# EAGLE design SMS to Genesis (EAGLE 6.5.0)
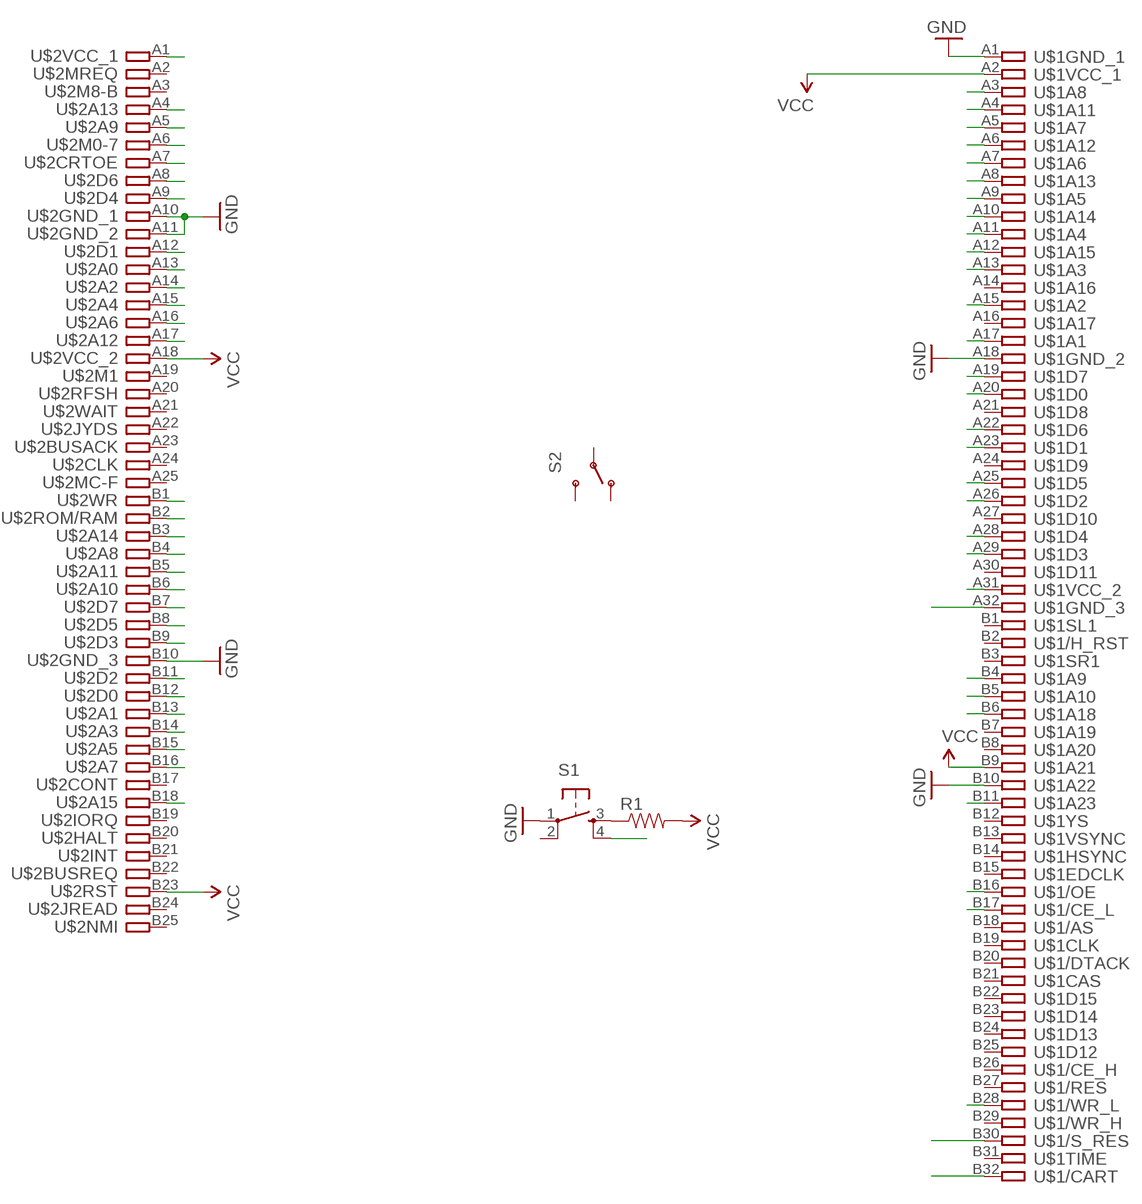
[diagram p0: schematic, sheet 1]

## Parts
R1  RESISTOR0805-RES  [0805]
S1  TAC_SWITCHSMD  [TACTILE-SWITCH-SMD]
S2  SWITCH-SPDTPTH  [SWITCH-SPDT]
U$1  GENESIS-LARGE  [GENESIS-LARGE]
U$2  SMS-R  [SMS]

## Nets
A3: U$1.A3 U$2.B16
A4: U$1.A4 U$2.B6
A5: U$1.A5 U$2.A16
A6: U$1.A6 U$2.B5
A7: U$1.A7 U$2.B15
A8: U$1.A8 U$2.A17
A9: U$1.A9 U$2.A15
A10: U$1.A10 U$2.A4
A11: U$1.A11 U$2.B14
A12: U$1.A12 U$2.B3
A13: U$1.A13 U$2.A14
A15: U$1.A15 U$2.B13
A17: U$1.A17 U$2.A13
A19: U$1.A19 U$2.B7
A20: U$1.A20 U$2.B12
A22: U$1.A22 U$2.A8
A23: U$1.A23 U$2.A12
A25: U$1.A25 U$2.B8
A26: U$1.A26 U$2.B11
A28: U$1.A28 U$2.A9
A29: U$1.A29 U$2.B9
A31: U$1.A31 U$2.A1
B4: U$1.B4 U$2.B4
B5: U$1.B5 U$2.A5
B6: U$1.B6 U$2.A7
B11: S1.4 U$1.B11
B16: U$1.B16 U$2.B2
B17: U$1.B17 U$2.A6 U$2.B18
B28: U$1.B28 U$2.B1
GND: S1.1 U$1.A1 U$1.A18 U$1.B10 U$2.A10 U$2.A11 U$2.B10
N$1: R1.1 S1.3
SMS: U$1.A32 U$1.B30 U$1.B32
VCC: R1.2 U$1.A2 U$1.B9 U$2.A18 U$2.B23
Unconnected: S1.2 S2.1(O) S2.2(P) S2.3(S) U$1.A14 U$1.A16 U$1.A21 U$1.A24 U$1.A27 U$1.A30 U$1.B1 U$1.B2 U$1.B3 U$1.B7 U$1.B8 U$1.B12 U$1.B13 U$1.B14 U$1.B15 U$1.B18 U$1.B19 U$1.B20 U$1.B21 U$1.B22 U$1.B23 U$1.B24 U$1.B25 U$1.B26 U$1.B27 U$1.B29 U$1.B31 U$2.A2 U$2.A3 U$2.A19 U$2.A20 U$2.A21 U$2.A22 U$2.A23 U$2.A24 U$2.A25 U$2.B17 U$2.B19 U$2.B20 U$2.B21 U$2.B22 U$2.B24 U$2.B25

## Library data of the parts
R1 = SparkFun-Passives:RESISTOR: Resistor Basic schematic elements and footprints for 0603, 1206, and PTH resistors.
S1 = SparkFun-Electromechanical:TAC_SWITCH: Momentary Switch Button commonly used for reset or general input. Spark Fun Electronics SKU : COM-00097 SMT- SWCH-08247
S2 = SparkFun-Electromechanical:SWITCH-SPDT: SPDT Switch Simple slide switch, Spark Fun Electronics SKU : COM-00102 DPDT SMT slide switch, AYZ0202, SWCH-08179
U$1 = genesis:GENESIS: Sega Genesis cartridge connector
U$2 = sms:SMS-R: Sega Master System cartridge connector, reversed

## Board
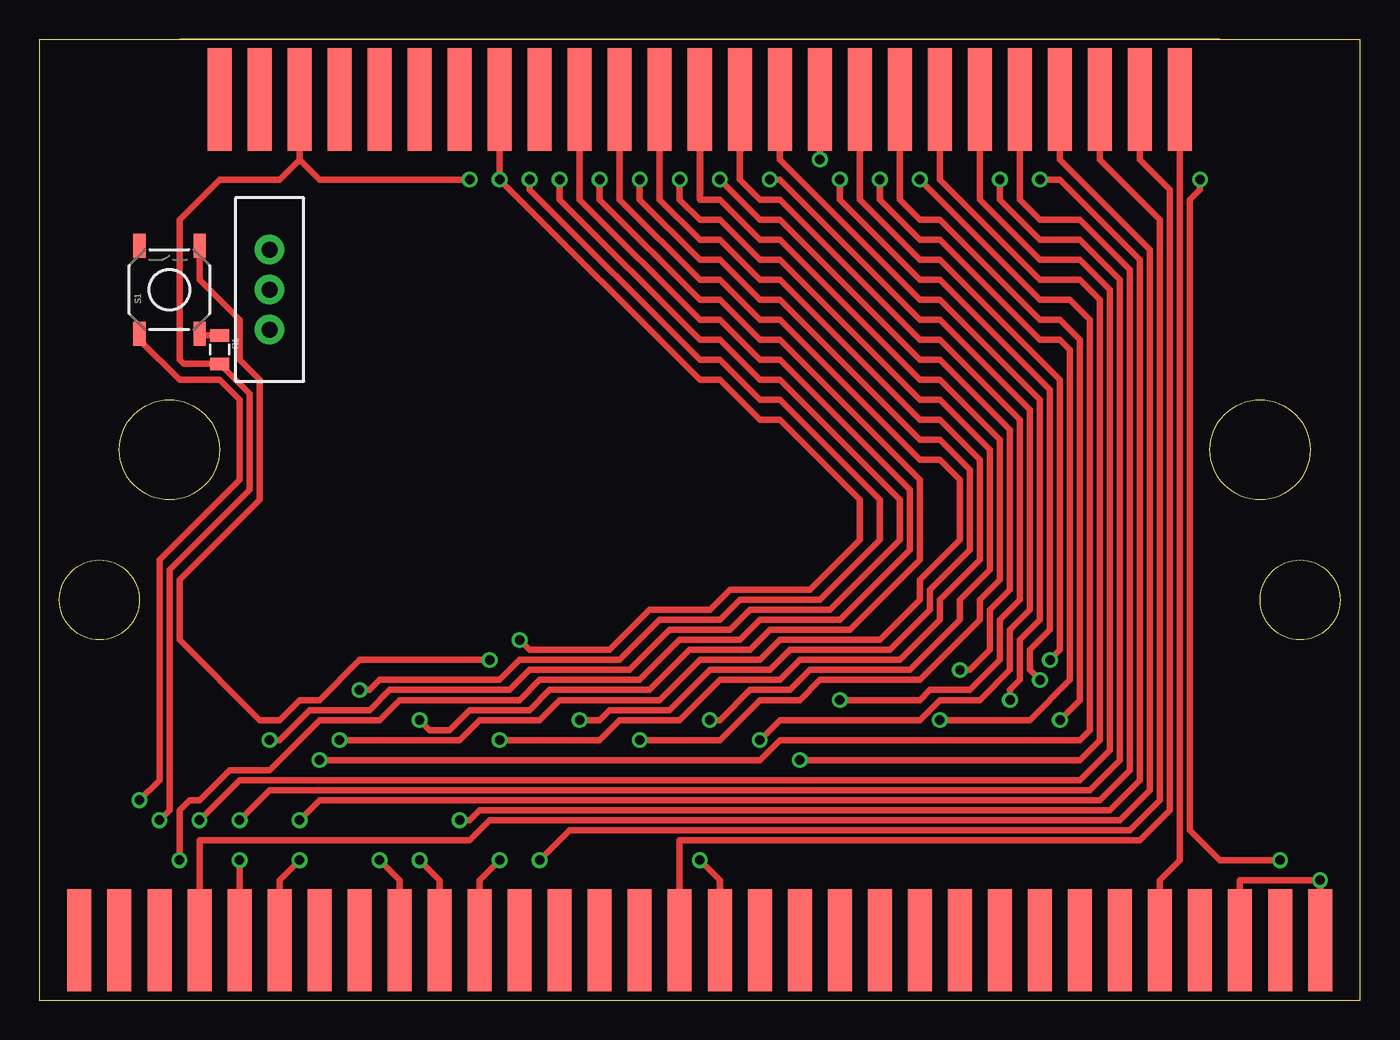
[diagram p1: board, top side]
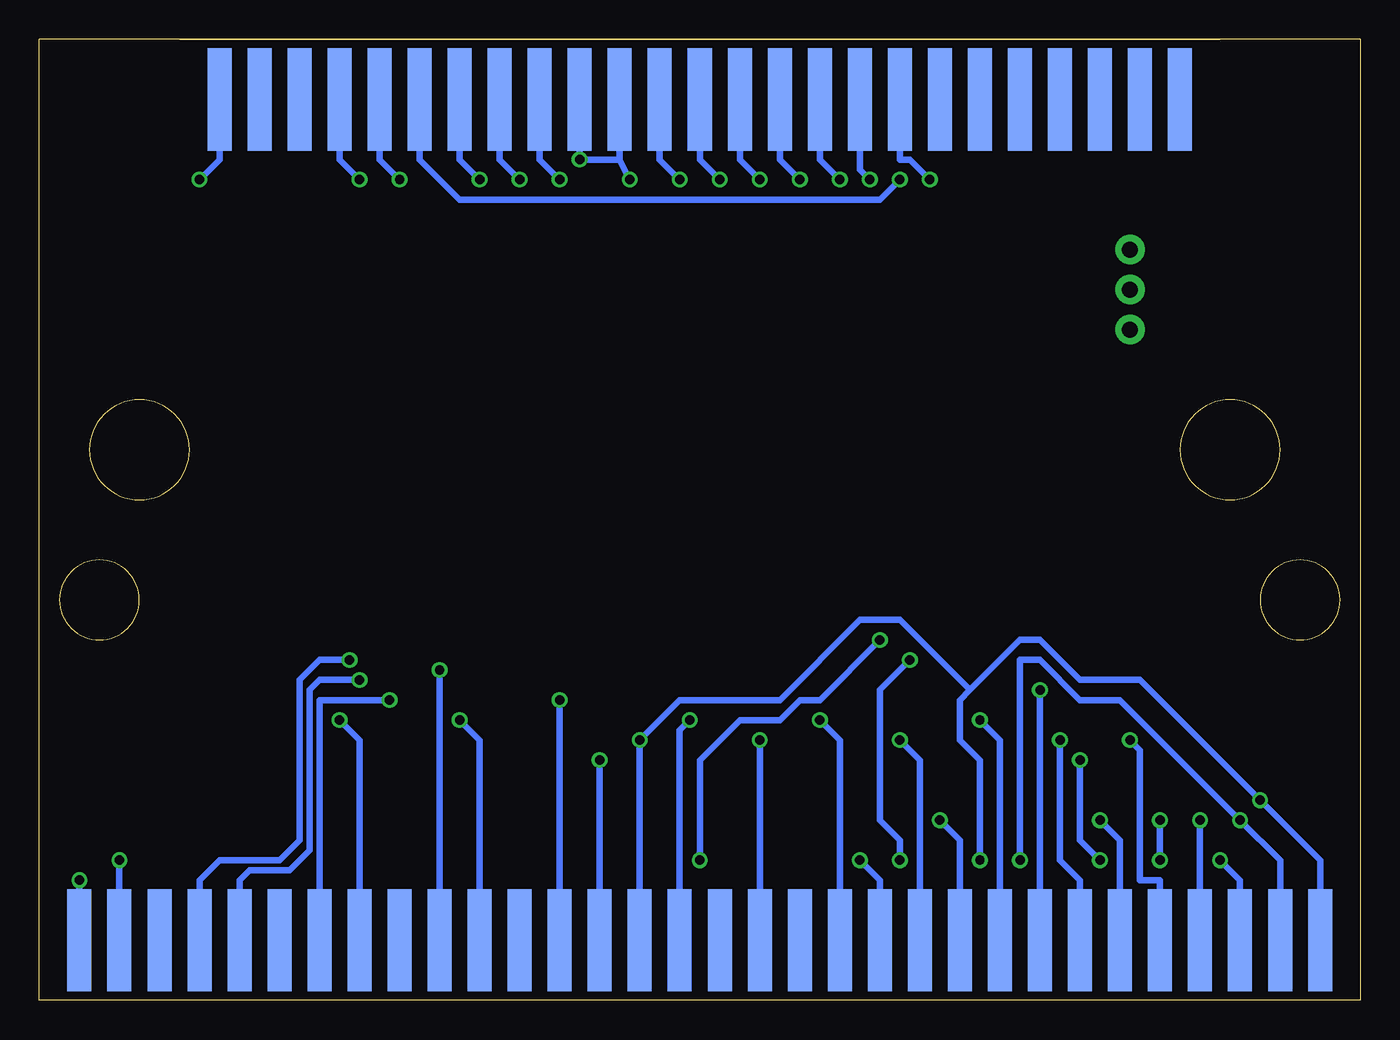
[diagram p2: board, bottom side, seen from below]

Size 83.82 x 60.96 mm. Coordinates in mm from the lower left corner, seen from the top.
Copper layers (1*16): Top 0.035mm / dielectric 1.5mm / Bottom 0.035mm
Design rules "default": minimum track width 10mil, minimum drill 0.6mm, track to track 8mil, track to pad 8mil, pad to pad 8mil, via to via 8mil, smd to smd 8mil, copper to edge 40mil, drill to drill 8mil, minimum pad ring 10mil, minimum via ring 8mil, stop-mask expansion 4mil, vias tented up to drill 0mil, thermal gap 10mil

### Footprints (pad centres in the part's own frame; a part is rotated, then mirrored left to right if it is on the bottom)
0805 = smd 0.8 x 1.2: 1 -0.9,0; 2 0.9,0
TACTILE-SWITCH-SMD = smd 1.524 x 0.762: 1 -2.794,1.905; 2 2.794,1.905; 3 -2.794,-1.905; 4 2.794,-1.905
SWITCH-SPDT = drill 1.016 pad 1.88: 1 0,2.54; 2 0,0; 3 0,-2.54
GENESIS-LARGE = smd 1.524 x 6.477 bottom: A1 2.54,3.81; A2 5.08,3.81; A3 7.62,3.81; A4 10.16,3.81; A5 12.7,3.81; A6 15.24,3.81; A7 17.78,3.81; A8 20.32,3.81; A9 22.86,3.81; A10 25.4,3.81; A11 27.94,3.81; A12 30.48,3.81; A13 33.02,3.81; A14 35.56,3.81; A15 38.1,3.81; A16 40.64,3.81; A17 43.18,3.81; A18 45.72,3.81; A19 48.26,3.81; A20 50.8,3.81; A21 53.34,3.81; A22 55.88,3.81; A23 58.42,3.81; A24 60.96,3.81; A25 63.5,3.81; A26 66.04,3.81; A27 68.58,3.81; A28 71.12,3.81; A29 73.66,3.81; A30 76.2,3.81; A31 78.74,3.81; A32 81.28,3.81 | smd 1.524 x 6.477: B1 2.54,3.81; B2 5.08,3.81; B3 7.62,3.81; B4 10.16,3.81; B5 12.7,3.81; B6 15.24,3.81; B7 17.78,3.81; B8 20.32,3.81; B9 22.86,3.81; B10 25.4,3.81; B11 27.94,3.81; B12 30.48,3.81; B13 33.02,3.81; B14 35.56,3.81; B15 38.1,3.81; B16 40.64,3.81; B17 43.18,3.81; B18 45.72,3.81; B19 48.26,3.81; B20 50.8,3.81; B21 53.34,3.81; B22 55.88,3.81; B23 58.42,3.81; B24 60.96,3.81; B25 63.5,3.81; B26 66.04,3.81; B27 68.58,3.81; B28 71.12,3.81; B29 73.66,3.81; B30 76.2,3.81; B31 78.74,3.81; B32 81.28,3.81
SMS = smd 1.524 x 6.477 bottom: A1 2.54,3.81; A2 5.08,3.81; A3 7.62,3.81; A4 10.16,3.81; A5 12.7,3.81; A6 15.24,3.81; A7 17.78,3.81; A8 20.32,3.81; A9 22.86,3.81; A10 25.4,3.81; A11 27.94,3.81; A12 30.48,3.81; A13 33.02,3.81; A14 35.56,3.81; A15 38.1,3.81; A16 40.64,3.81; A17 43.18,3.81; A18 45.72,3.81; A19 48.26,3.81; A20 50.8,3.81; A21 53.34,3.81; A22 55.88,3.81; A23 58.42,3.81; A24 60.96,3.81; A25 63.5,3.81 | smd 1.524 x 6.477: B1 2.54,3.81; B2 5.08,3.81; B3 7.62,3.81; B4 10.16,3.81; B5 12.7,3.81; B6 15.24,3.81; B7 17.78,3.81; B8 20.32,3.81; B9 22.86,3.81; B10 25.4,3.81; B11 27.94,3.81; B12 30.48,3.81; B13 33.02,3.81; B14 35.56,3.81; B15 38.1,3.81; B16 40.64,3.81; B17 43.18,3.81; B18 45.72,3.81; B19 48.26,3.81; B20 50.8,3.81; B21 53.34,3.81; B22 55.88,3.81; B23 58.42,3.81; B24 60.96,3.81; B25 63.5,3.81

### Placement (x,y rotation side)
R1  11.43,41.27 270 top
S1  8.26,45.09 90 top
S2  14.61,45.09 0 top
U$1  0,0 0 top
U$2  74.93,60.96 180 top

### Tracks (layer width: path | path; a pad name or v marks a point on that pad's centre or on a via)
A3  (via drill 0.6)
  Top 0.406: U$2.B16 34.29,50.8 41.91,43.18 43.18,43.18 45.72,40.64 46.99,40.64 55.24,32.38 55.24,28.57 50.8,24.13 45.72,24.13 44.45,22.86 40.64,22.86 38.1,20.32 31.75,20.32 30.48,19.05 22.86,19.05 21.59,17.78 17.78,17.78 14.61,14.61 12.06,14.61 10.16,12.7 9.53,12.7 8.89,12.06 v8.89,8.89
  Bottom 0.406: v8.89,8.89 7.62,7.62 U$1.A3
A4  (via drill 0.6)
  Top 0.406: U$2.B6 59.69,50.8 63.5,46.99 66.04,46.99 67.94,45.09 67.94,15.88 66.04,13.97 12.7,13.97 v10.16,11.43
  Bottom 0.406: v10.16,11.43 U$1.A4
A5  (via drill 0.6)
  Top 0.406: v33.02,52.07 33.02,50.8 41.91,41.91 43.18,41.91 45.72,39.37 46.99,39.37 54.61,31.75 54.61,29.21 50.16,24.77 45.09,24.77 43.81,23.5 40.01,23.5 37.47,20.95 31.11,20.95 29.84,19.68 22.23,19.68 20.95,18.41 17.14,18.41 15.24,16.51 v14.61,16.51
  Bottom 0.406: U$2.A16 34.29,53.34 v33.02,52.07 | v14.61,16.51 13.97,15.88 13.97,7.62 12.7,7.62 U$1.A5
A6  (via drill 0.6)
  Top 0.406: U$2.B5 62.23,50.8 63.5,49.53 66.04,49.53 69.22,46.35 69.22,14.61 67.31,12.7 17.78,12.7 v16.51,11.43
  Bottom 0.406: v16.51,11.43 15.24,10.16 U$1.A6
A7  (via drill 0.6)
  Top 0.406: U$2.B15 36.83,50.8 41.91,45.72 43.18,45.72 45.72,43.18 46.99,43.18 55.88,34.29 57.15,34.29 58.42,33.02 58.42,29.21 55.88,26.67 55.88,25.4 53.34,22.86 46.99,22.86 45.72,21.59 41.91,21.59 39.37,19.05 33.02,19.05 31.75,17.78 27.94,17.78 26.67,16.51 v19.05,16.51
  Bottom 0.406: v19.05,16.51 19.05,8.89 17.78,7.62 U$1.A7
A8  (via drill 0.6)
  Top 0.406: v20.32,19.68 20.95,19.68 21.59,20.32 29.21,20.32 30.48,21.59 36.83,21.59 39.37,24.13 43.18,24.13 44.45,25.4 49.53,25.4 53.34,29.21 53.34,31.75 46.99,38.1 45.72,38.1 43.18,40.64 41.91,40.64 31.11,51.44 v31.11,52.07
  Bottom 0.406: U$2.A17 31.75,52.7 v31.11,52.07 | v20.32,19.68 U$1.A8
A9  (via drill 0.6)
  Top 0.406: v35.56,52.07 35.56,50.8 41.91,44.45 43.18,44.45 45.72,41.91 46.99,41.91 55.88,33.02 55.88,27.94 51.44,23.5 46.35,23.5 45.09,22.23 41.27,22.23 38.73,19.68 32.38,19.68 31.11,18.41 27.3,18.41 26.04,17.14 24.77,17.14 v24.13,17.78
  Bottom 0.406: U$2.A15 36.83,53.34 v35.56,52.07 | v24.13,17.78 22.86,16.51 U$1.A9
A10  (via drill 0.6)
  Top 0.406: v63.5,52.07 64.77,52.07 69.85,46.99 69.85,13.97 67.94,12.06 27.94,12.06 27.3,11.43 v26.67,11.43
  Bottom 0.406: U$1.A10 25.4,10.16 v26.67,11.43 | v63.5,52.07 64.77,53.34 U$2.A4
A11  (via drill 0.6)
  Top 0.406: U$2.B14 39.37,50.8 41.91,48.26 43.18,48.26 45.72,45.72 46.99,45.72 55.88,36.83 57.15,36.83 59.69,34.29 59.69,27.94 57.15,25.4 57.15,24.13 54.61,21.59 48.26,21.59 46.99,20.32 43.18,20.32 40.64,17.78 36.83,17.78 35.56,16.51 v29.21,16.51
  Bottom 0.406: v29.21,16.51 27.94,15.24 U$1.A11
A12  (via drill 0.6)
  Top 0.406: U$2.B3 67.31,53.34 71.12,49.53 71.12,12.7 69.22,10.79 33.66,10.79 v31.75,8.89
  Bottom 0.406: v31.75,8.89 30.48,7.62 U$1.A12
A13  (via drill 0.6)
  Top 0.406: v38.1,52.07 38.1,50.8 41.91,46.99 43.18,46.99 45.72,44.45 46.99,44.45 55.88,35.56 57.15,35.56 59.05,33.66 59.05,28.57 56.52,26.04 56.52,24.77 53.98,22.23 47.62,22.23 46.35,20.95 42.55,20.95 40.01,18.41 36.2,18.41 35.56,17.78 v34.29,17.78
  Bottom 0.406: U$2.A14 39.37,53.34 v38.1,52.07 | v34.29,17.78 33.02,16.51 U$1.A13
A15  (via drill 0.6)
  Top 0.406: U$2.B13 41.91,50.8 43.18,50.8 45.72,48.26 46.99,48.26 55.88,39.37 57.15,39.37 60.96,35.56 60.96,26.67 59.69,25.4 59.69,24.13 55.88,20.32 49.53,20.32 48.26,19.05 45.72,19.05 43.18,16.51 v38.1,16.51
  Bottom 0.406: v38.1,16.51 U$1.A15
A17  (via drill 0.6)
  Top 0.406: v40.64,52.07 40.64,50.8 41.91,49.53 43.18,49.53 45.72,46.99 46.99,46.99 55.88,38.1 57.15,38.1 60.33,34.92 60.33,27.3 58.42,25.4 58.42,24.13 55.24,20.95 48.9,20.95 47.62,19.68 45.09,19.68 43.18,17.78 v42.55,17.78
  Bottom 0.406: U$2.A13 41.91,53.34 v40.64,52.07 | v42.55,17.78 43.18,17.14 U$1.A17
A19  (via drill 0.6)
  Top 0.406: U$2.B7 57.15,52.07 63.5,45.72 66.04,45.72 67.31,44.45 67.31,16.51 66.04,15.24 v48.26,15.24
  Bottom 0.406: v48.26,15.24 U$1.A19
A20  (via drill 0.6)
  Top 0.406: U$2.B12 44.45,52.07 45.72,50.8 46.99,50.8 55.88,41.91 57.15,41.91 62.23,36.83 62.23,25.4 60.96,24.13 60.96,21.59 59.05,19.68 56.52,19.68 55.88,19.05 v50.8,19.05
  Bottom 0.406: v50.8,19.05 U$1.A20
A22  (via drill 0.6)
  Top 0.406: v53.34,52.07 53.34,50.8 55.88,48.26 57.15,48.26 63.5,41.91 64.77,41.91 65.41,41.27 65.41,20.32 62.87,17.78 v57.15,17.78
  Bottom 0.406: U$2.A8 54.61,53.34 v53.34,52.07 | v57.15,17.78 55.88,16.51 U$1.A22
A23  (via drill 0.6)
  Top 0.406: v43.18,52.07 45.72,49.53 46.99,49.53 55.88,40.64 57.15,40.64 61.59,36.2 61.59,26.04 60.33,24.77 60.33,22.23 59.05,20.95 v58.42,20.95
  Bottom 0.406: U$2.A12 44.45,53.34 v43.18,52.07 | v58.42,20.95 U$1.A23
A25  (via drill 0.6)
  Top 0.406: U$2.B8 54.61,50.8 55.88,49.53 57.15,49.53 63.5,43.18 64.77,43.18 66.04,41.91 66.04,19.05 v64.77,17.78
  Bottom 0.406: v64.77,17.78 63.5,16.51 U$1.A25
A26  (via drill 0.6)
  Top 0.406: U$2.B11 46.99,53.34 55.88,44.45 57.15,44.45 63.5,38.1 63.5,24.13 62.23,22.86 62.23,20.32 61.59,19.68 v61.59,19.05
  Bottom 0.406: U$1.A26 66.04,19.05 v61.59,19.05
A28  (via drill 0.6)
  Top 0.406: v50.8,52.07 50.8,50.8 55.88,45.72 57.15,45.72 64.14,38.73 64.14,23.5 62.87,22.23 62.87,20.95 v63.5,20.32
  Bottom 0.406: U$2.A9 52.07,53.34 v50.8,52.07 | U$1.A28 71.12,7.62 70.48,8.26 67.94,8.26 66.67,9.53 66.67,19.68 66.04,20.32 v63.5,20.32
A29  (via drill 0.6)
  Top 0.406: U$2.B9 52.07,50.8 55.88,46.99 57.15,46.99 64.77,39.37 64.77,22.23 v64.14,21.59
  Bottom 0.406: U$1.A29 73.66,7.62 72.39,8.89 68.58,8.89 67.31,10.16 67.31,20.32 66.04,21.59 v64.14,21.59
A31  (via drill 0.6)
  Top 0.406: v73.66,52.07 73.66,51.44 73.03,50.8 73.03,10.79 74.93,8.89 v78.74,8.89
  Bottom 0.406: U$2.A1 72.39,53.34 v73.66,52.07 | v78.74,8.89 U$1.A31
B4
  Top 0.406: U$2.B4 64.77,53.34 70.48,47.62 70.48,13.34 68.58,11.43 28.57,11.43 27.3,10.16 10.16,10.16 U$1.B4
B5  (via drill 0.6)
  Top 0.406: v60.96,52.07 60.96,50.8 63.5,48.26 66.04,48.26 68.58,45.72 68.58,15.24 66.67,13.34 14.61,13.34 v12.7,11.43 | v12.7,8.89 U$1.B5
  Bottom 0.406: U$2.A5 62.23,53.34 v60.96,52.07 | v12.7,11.43 v12.7,8.89
B6  (via drill 0.6)
  Top 0.406: v55.88,52.07 63.5,44.45 65.41,44.45 66.67,43.18 66.67,17.14 66.04,16.51 46.99,16.51 45.72,15.24 v17.78,15.24 | v16.51,8.89 15.24,7.62 U$1.B6
  Bottom 0.406: U$2.A7 57.15,53.34 v55.88,52.07 | v17.78,15.24 17.78,10.16 v16.51,8.89
B11  (via drill 0.6)
  Top 0.406: v28.57,21.59 20.32,21.59 17.78,19.05 16.51,19.05 15.24,17.78 13.97,17.78 8.89,22.86 8.89,26.67 13.97,31.75 13.97,39.37 12.7,40.64 12.7,43.18 10.16,45.72 S1.4 | v29.21,8.89 27.94,7.62 U$1.B11
  Bottom 0.406: v28.57,21.59 30.48,19.68 30.48,11.43 29.21,10.16 v29.21,8.89
B16
  Top 0.406: U$2.B2 69.85,53.34 71.75,51.44 71.75,12.06 69.85,10.16 40.64,10.16 U$1.B16
B17  (via drill 0.6)
  Top 0.406: U$1.B17 43.18,7.62 v41.91,8.89 | v30.48,22.86 31.11,22.23 36.2,22.23 38.73,24.77 42.55,24.77 43.81,26.04 48.9,26.04 52.07,29.21 52.07,31.75 46.99,36.83 45.72,36.83 43.18,39.37 41.91,39.37 v29.21,52.07 U$2.B18
  Bottom 0.406: v29.21,52.07 30.48,50.8 57.15,50.8 59.69,53.34 U$2.A6 | v41.91,8.89 41.91,15.24 39.37,17.78 36.83,17.78 35.56,19.05 34.29,19.05 v30.48,22.86
B28
  Top 0.406: U$2.B1 72.39,8.89 71.12,7.62 U$1.B28
GND  (via drill 0.6)
  Top 0.406: U$2.B10 v49.53,53.34 | v45.72,16.51 46.99,17.78 55.88,17.78 57.15,19.05 59.69,19.05 61.59,20.95 61.59,23.5 62.87,24.77 62.87,37.47 57.15,43.18 55.88,43.18 46.99,52.07 v46.35,52.07 | U$1.B10 25.4,7.62 v24.13,8.89 | v6.35,12.7 7.62,13.97 7.62,27.94 12.7,33.02 12.7,38.1 11.43,39.37 8.89,39.37 6.35,41.91 S1.1
  Bottom 0.406: 46.99,53.34 v49.53,53.34 U$2.B10 | U$2.A11 46.99,53.34 | v46.35,52.07 46.99,53.34 | v24.13,8.89 24.13,15.24 25.4,16.51 25.4,19.05 24.77,19.68 | 24.77,19.68 21.59,22.86 20.32,22.86 17.78,20.32 13.97,20.32 v6.35,12.7 2.54,8.89 U$1.A1 | U$1.A18 v45.72,16.51 43.18,19.05 36.83,19.05 31.75,24.13 29.21,24.13 24.77,19.68
N$1
  Top 0.406: R1.1 10.28,42.17 S1.3
SMS  (via drill 0.6)
  Top 0.406: U$1.B30 76.2,7.62 v81.28,7.62 U$1.B32
  Bottom 0.406: U$1.B32 v81.28,7.62
VCC  (via drill 0.6)
  Top 0.406: U$2.B23 16.51,53.34 | 16.51,53.34 17.78,52.07 v27.3,52.07 | v21.59,8.89 22.86,7.62 U$1.B9 | 16.51,53.34 15.24,52.07 11.43,52.07 8.89,49.53 8.89,40.64 9.15,40.38 R1.2 13.34,38.47 13.34,32.38 8.26,27.3 8.26,12.06 v7.62,11.43
  Bottom 0.406: v21.59,8.89 21.59,21.59 20.32,21.59 17.78,19.05 15.24,19.05 v7.62,11.43 5.08,8.89 U$1.A2 | U$2.A18 29.21,53.34 28.57,53.34 v27.3,52.07